# EasyEDA Pro project Flex-touch.eprj

# Schematic FlexTouch
Board Name: Board1; Create Date: 2025-05-13; Page Name: P1; Project Name: Flex-touch; Schematic Name: FlexTouch; Update Date: 2025-05-24; Company: EasyEDA.com; Page Size: A4; Version: V1.0
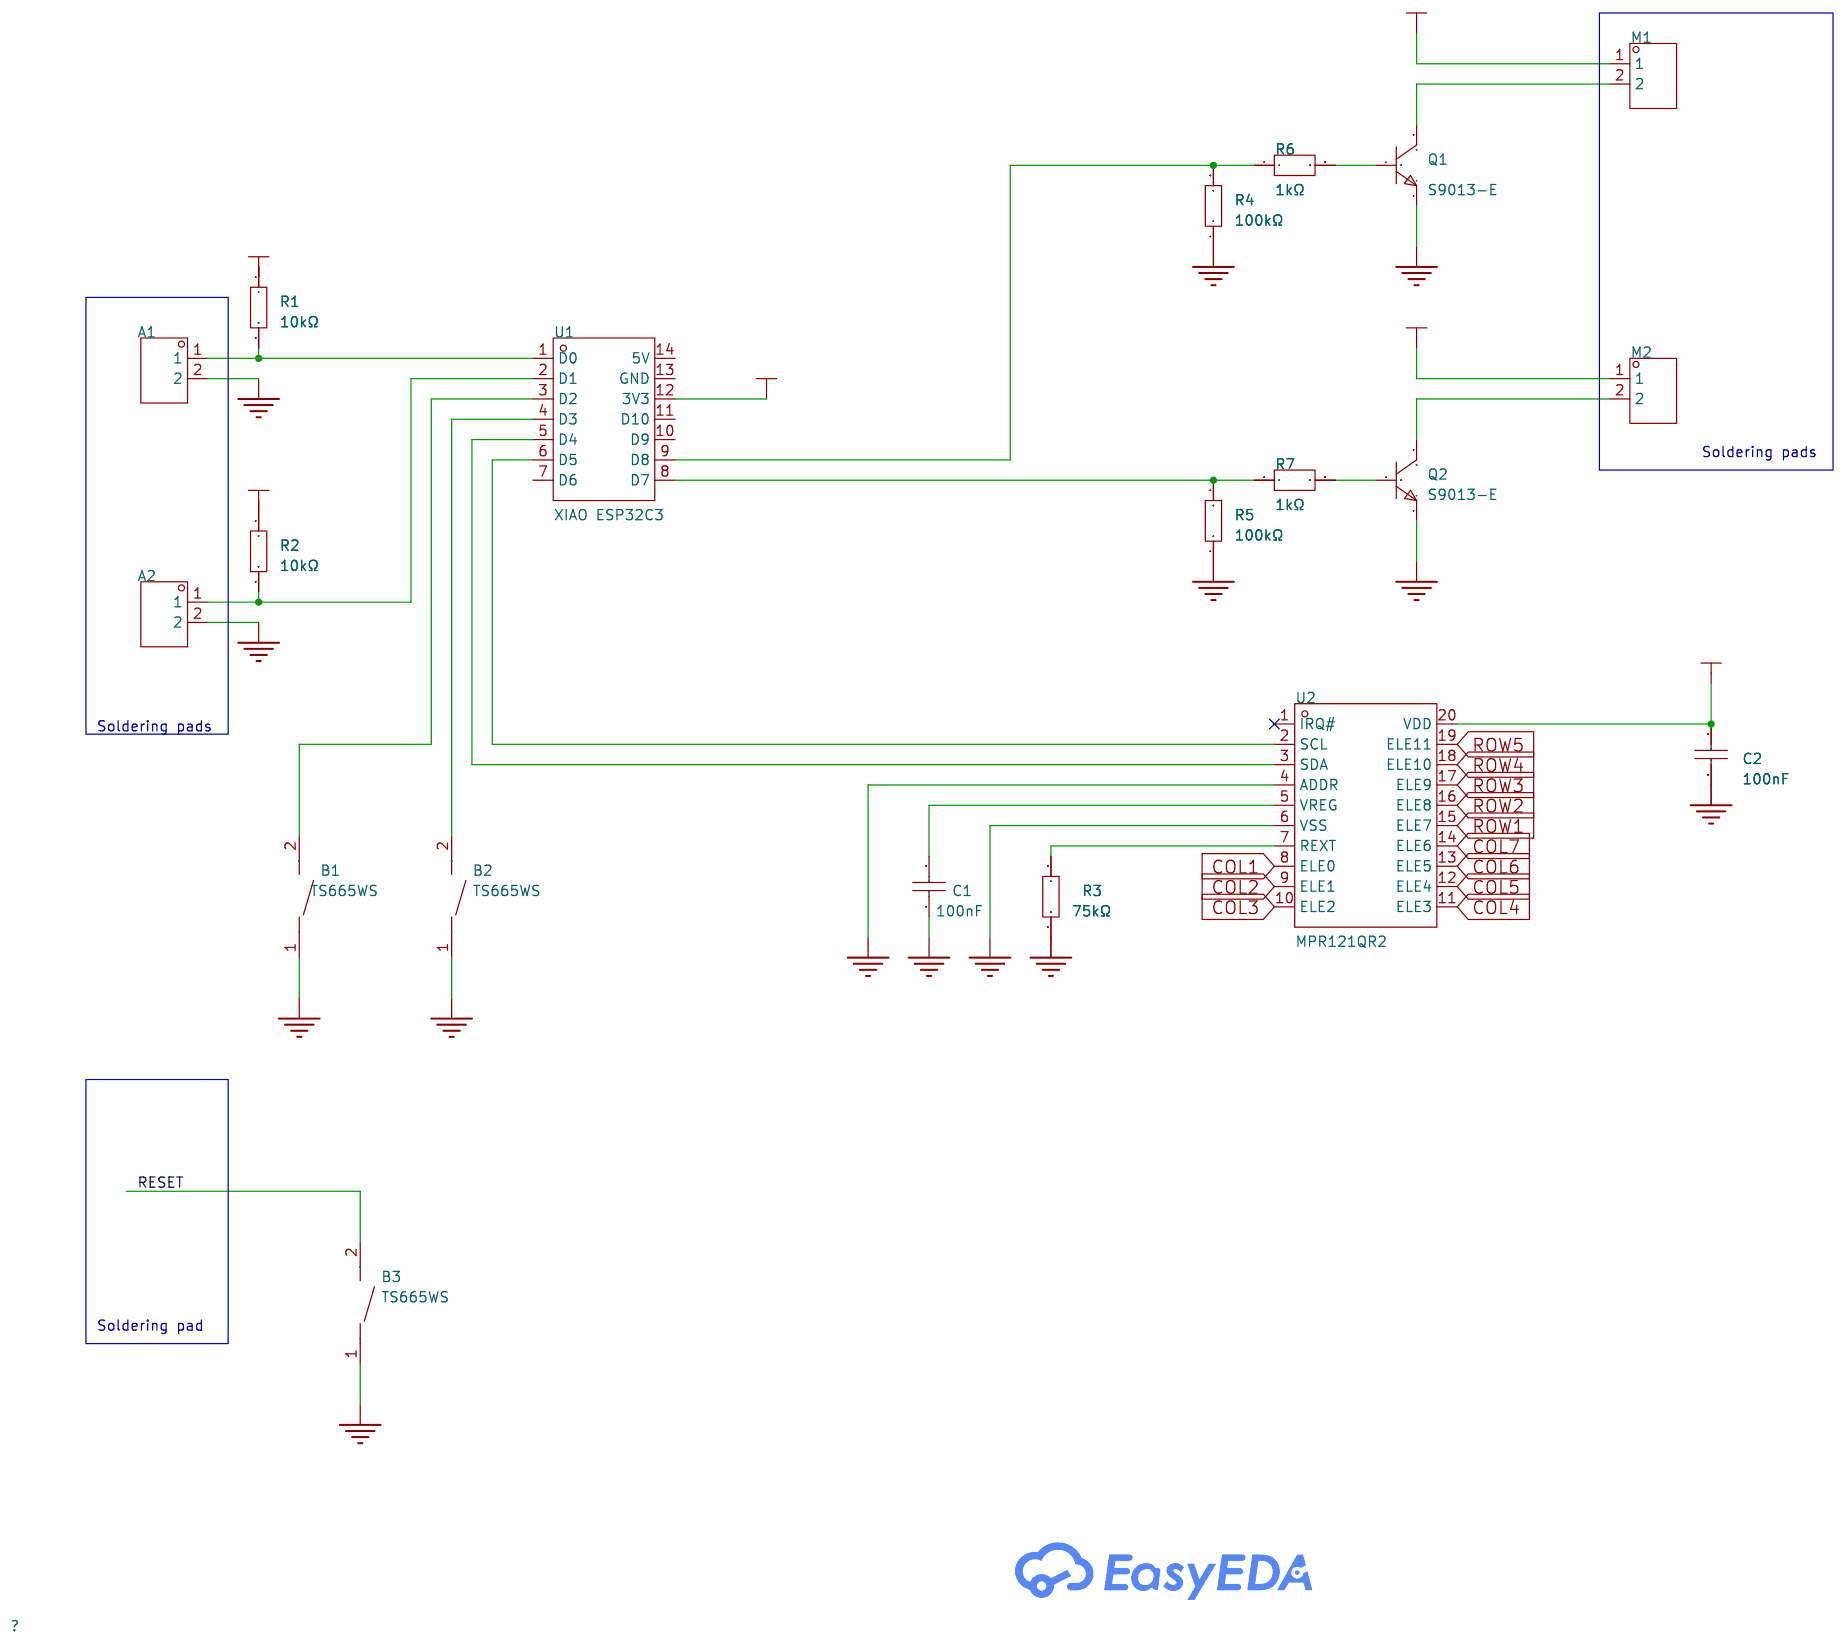
[diagram p0: schematic sheet]

## Parts
A1  B-2200S02P-A120  [HDR-TH_2P-P2.54-V-F]
A2  B-2200S02P-A120  [HDR-TH_2P-P2.54-V-F]
B1  TS665WS  [SW-SMD_L6.0-W6.0-LS6.6]
B2  TS665WS  [SW-SMD_L6.0-W6.0-LS6.6]
B3  TS665WS  [SW-SMD_L6.0-W6.0-LS6.6]
C1  100nF  [C0603]
C2  100nF  [C0603]
M1  B-2200S02P-A120  [HDR-TH_2P-P2.54-V-F]
M2  B-2200S02P-A120  [HDR-TH_2P-P2.54-V-F]
Q1  S9013-E  [SOT-23-3_L2.9-W1.3-P1.90-LS2.4-BR]
Q2  S9013-E  [SOT-23-3_L2.9-W1.3-P1.90-LS2.4-BR]
R1  10kΩ  [R0603]
R2  10kΩ  [R0603]
R3  75kΩ  [R0603]
R4  100kΩ  [R0603]
R5  100kΩ  [R0603]
R6  1kΩ  [R0603]
R7  1kΩ  [R0603]
U1  XIAO ESP32C3  [COMM-SMD_KQ-2801_V106]
U2  MPR121QR2  [QFN-20_L3.0-W3.0-P0.40-BL]

## Library data of the parts
A1 A2 M1 M2 = B-2200S02P-A120: 插孔结构:1x2P;间距:2.54mm;行距:-;安装类型:直插;排数:单排;总孔位数:2P;塑高:-;触头材质:黄铜;触头镀层:-;; LCSC Part Name: 间距:2.54mm 1x2P 直插; Supplier Part: C124411; Manufacturer: Ckmtw(灿科盟); Supplier Footprint: 插件,P=2.54mm; JLCPCB Part Class: Extended Part; Datasheet: https://atta.szlcsc.com/upload/public/pdf/source/20170821/C124418_1503303326113901572.pdf; Supplier: LCSC; Holes Structure: 1x2P; Pitch: 2.54mm; Mounting Type: 直插; Number of Rows: 单排; Number of Holes: 2P; Contact Material: 黄铜
B1-B3 = TS665WS_C398058: LCSC Part Name: 6*6*5mm 立贴 轻触开关; Supplier Part: C398058; Manufacturer: SHOU HAN(首韩); Supplier Footprint: SMD; JLCPCB Part Class: Extended Part; Datasheet: https://atta.szlcsc.com/upload/public/pdf/source/20190620/C398058_75EC11C2CCBC6DD113AE79D58CB25A40.pdf; Supplier: LCSC; Circuit: SPST; Actuator Style: Round Button; Operating Force: 200gf; Mounting Style: Brick nogging; Switch Length: 6mm; Switch Width: 6mm; Switch Height: 5mm; Contact Current: 50mA; Voltage Rating (DC): 12V
C1 C2 = 0603B104K500NT_C30926: LCSC Part Name: 100nF ±10% 50V; Supplier Part: C30926; Manufacturer: FH(风华); Manufacturer Part: 0603B104K500NT; Supplier Footprint: 0603; JLCPCB Part Class: Extended Part; Datasheet: https://atta.szlcsc.com/upload/public/pdf/source/20200305/C486355_26A10D38EF8C2A5C37091D0039909270.pdf; Supplier: LCSC; Tolerance: ±10%; Voltage Rating: 50V; Temperature Coefficient: X7R
Q1 Q2 = S9013-E: 晶体管类型:NPN;集电极电流(Ic):500mA;集射极击穿电压(Vceo):25V;耗散功率(Pd):300mW;直流电流增益(hFE):120@50mA,1V;; Supplier Part: C41371419; Manufacturer: MDD(辰达半导体); Supplier Footprint: SOT-23; JLCPCB Part Class: Extended Part; Datasheet: https://atta.szlcsc.com/upload/public/pdf/source/20241113/4DDBD2B8A7B6A974495B9B970C95E559.pdf; Supplier: LCSC; type: NPN; Current - Collector(Ic): 500mA; Collector - Emitter Voltage VCEO: 25V; Pd - Power Dissipation: 300mW; DC Current Gain: 120@50mA,1V; Transition frequency(fT): 150MHz; Current - Collector Cutoff: 100nA; Vce Saturation(VCE(sat)): 600mV; Operating Temperature: -55℃~+150℃
R1 R2 = RC0603FR-0710KL: LCSC Part Name: 厚膜电阻 10kΩ ±1% 100mW; Supplier Part: C98220; Manufacturer: YAGEO(国巨); Supplier Footprint: 0603; JLCPCB Part Class: Extended Part; Datasheet: https://atta.szlcsc.com/upload/public/pdf/source/20180927/C295883_E8D83085EA81BD7DE0B2B681138C15EE.pdf; Supplier: LCSC; Type: Thick Film Resistors; Tolerance: ±1%; Temperature Coefficient: ±100ppm/℃; Operating Temperature Range: -55℃~+155℃
R3 = RTT03753JTP: LCSC Part Name: 厚膜电阻 75kΩ ±5% 100mW; Supplier Part: C103814; Manufacturer: RALEC(旺诠); Supplier Footprint: 0603; JLCPCB Part Class: Extended Part; Datasheet: https://atta.szlcsc.com/upload/public/pdf/source/20191219/C158410_884373A5B7E1BC76BF57BC45A946C093.pdf; Supplier: LCSC; Type: Thick Film Resistors; Tolerance: ±5%; Temperature Coefficient: ±100ppm/℃; Operating Temperature Range: -55℃~+155℃
R4 R5 = 0603WAF1003T5E: 电阻类型:厚膜电阻;阻值:100kΩ;精度:±1%;功率:100mW;最大工作电压:75V;温度系数:±100ppm/℃;; LCSC Part Name: 100kΩ ±1% 100mW 厚膜电阻; Supplier Part: C25803; Manufacturer: UNI-ROYAL(厚声); Supplier Footprint: 0603; JLCPCB Part Class: Basic Part; Datasheet: https://atta.szlcsc.com/upload/public/pdf/source/20200306/C422600_1E6D84923E4A46A82E41ADD87F860B5C.pdf; Supplier: LCSC; Type: 厚膜电阻; Tolerance: ±1%; Power(Watts): 100mW; Overload Voltage (Max): 75V; Temperature Coefficient: ±100ppm/℃; Operating Temperature Range: -55℃~+155℃
R6 R7 = SCR0603J1K: 电阻类型:厚膜电阻;阻值:1kΩ;精度:±5%;功率:100mW;最大工作电压:75V;; LCSC Part Name: 厚膜电阻 1kΩ ±5% 100mW; Supplier Part: C3017736; Manufacturer: VO(翔胜); Supplier Footprint: 0603; JLCPCB Part Class: Extended Part; Datasheet: https://atta.szlcsc.com/upload/public/pdf/source/20220513/247AF9639BA21CF93567DC289CCC6A22.pdf; Supplier: LCSC; Type: 厚膜电阻; Tolerance: ±5%; Power(Watts): 100mW; Overload Voltage (Max): 75V; Operating Temperature Range: -55℃~+155℃
U1 = XIAO ESP32C3: Supplier Part: C19189385; Supplier Footprint: QFN-32_5X5_EP3.7; JLCPCB Part Class: Extended Part; Supplier: LCSC
U2 = MPR121QR2: Supplier Part: C91322; Manufacturer: NXP(恩智浦); Supplier Footprint: QFN-20(3x3); JLCPCB Part Class: Extended Part; Datasheet: https://atta.szlcsc.com/upload/public/pdf/source/20240710/4D4C0BE290CAA2FB24355067A81EC58A.pdf; Supplier: LCSC

## Nets
3V3: C2.2 M1.1 M2.1 R1.1 R2.1 U1.12(3V3) U2.20(VDD)
GND: A1.2 A2.2 B1.1(A) B2.1(A) B3.1(A) C1.1 C2.1 Q1.2(E) Q2.2(E) R3.1 R4.1 R5.1 U2.4(ADDR) U2.6(VSS)
COL1: U2.8(ELE0)
COL2: U2.9(ELE1)
COL3: U2.10(ELE2)
COL4: U2.11(ELE3)
COL5: U2.12(ELE4)
COL6: U2.13(ELE5)
COL7: U2.14(ELE6)
RESET: B3.2(B)
ROW1: U2.15(ELE7)
ROW2: U2.16(ELE8)
ROW3: U2.17(ELE9)
ROW4: U2.18(ELE10)
ROW5: U2.19(ELE11)
$1N1686: M1.2 Q1.3(C)
$1N1688: R4.2 R6.1 U1.9(D8)
$1N1689: Q1.1(B) R6.2
$1N2010: R5.2 R7.1 U1.8(D7)
$1N2011: M2.2 Q2.3(C)
$1N2012: Q2.1(B) R7.2
$1N2784: C1.2 U2.5(VREG)
$1N2840: R3.2 U2.7(REXT)
$1N2947: U1.5(D4) U2.3(SDA)
$1N2951: U1.6(D5) U2.2(SCL)
$1N3138: A1.1 R1.2 U1.1(D0)
$1N3210: A2.1 R2.2 U1.2(D1)
$1N3281: B1.2(B) U1.3(D2)
$1N3291: B2.2(B) U1.4(D3)

Not connected (* = marked no-connect by the designer): U1 7(D6) 10(D9) 11(D10) 13(GND) 14(5V); U2 1(IRQ#)*

## Notes on the sheet
- Soldering pads
- Soldering pads
- Soldering pad

# Board PCB1
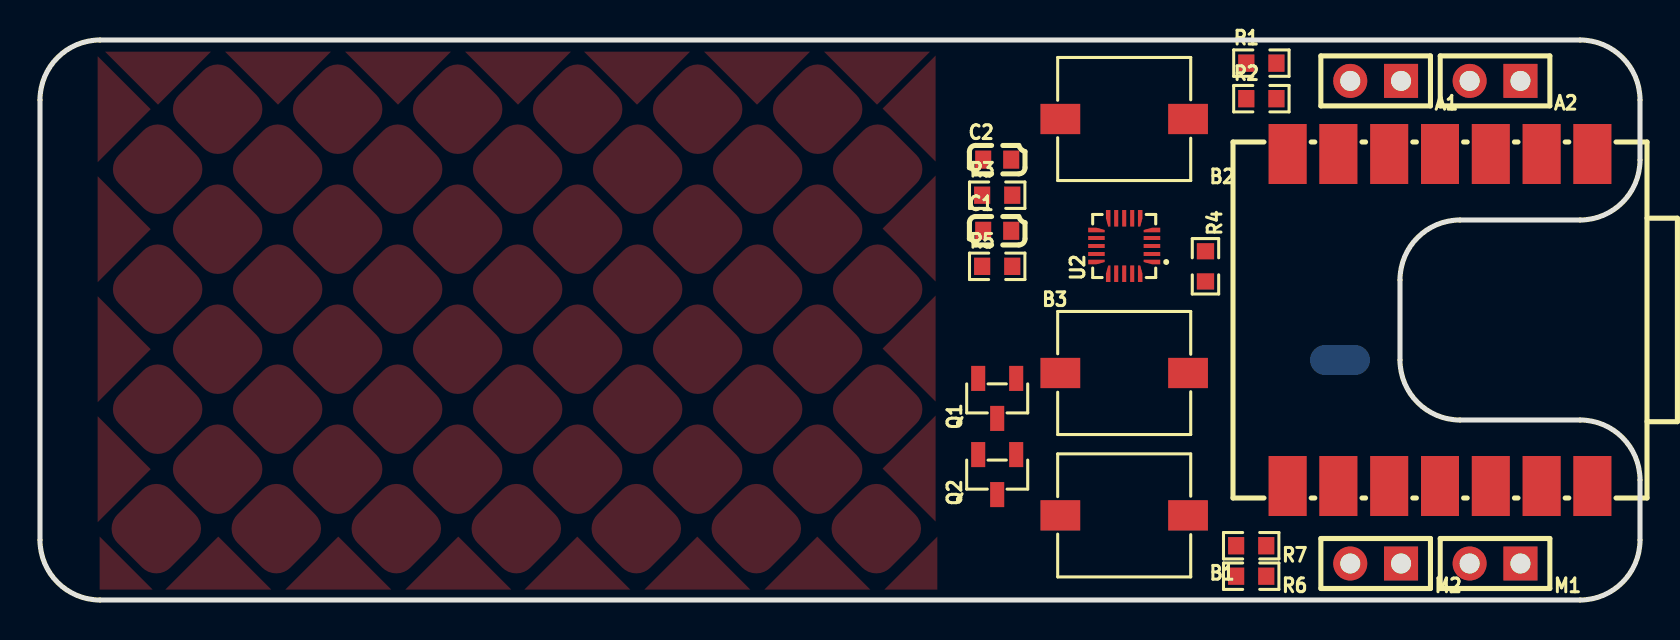
[diagram p1: board, top side]
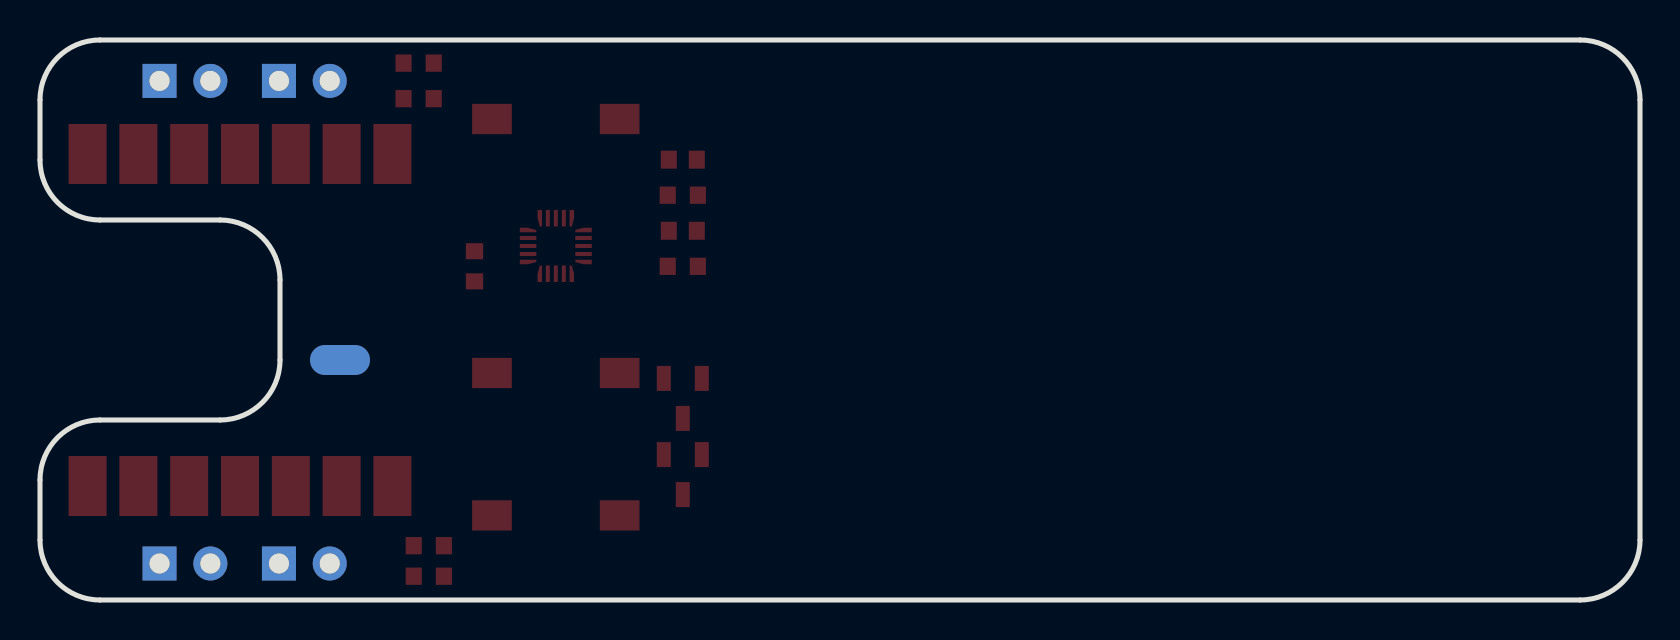
[diagram p2: board, bottom side, seen from below]

Outline 80 x 28 mm; copper layers: Top Layer, Bottom Layer. Coordinates in mm from the lower left corner of the outline.
Outline path: 0,25 arc(0.88,27.12) 3,28 77,28 arc(79.12,27.12) 80,25 80,22 arc(79.12,19.88) 77,19 71,19 arc(68.88,18.12) 68,16 68,12 arc(68.88,9.88) 71,9 77,9 arc(79.12,8.12) 80,6 80,3 arc(79.12,0.88) 77,0 3,0 arc(0.88,0.88) 0,3 0,25
Stack: Top Layer 0.035mm / Dielectric1 1.51mm FR4 er 4.5 / Bottom Layer 0.035mm

## Design rules (mm)
template: JLCPCB Capability(Two Layers Board)
spacing copperThickness1oz (default): track to track 0.102, other pairs 0.152 to 0.3
spacing copperThickness2oz: track to track 0.203, other pairs 0.152 to 0.3
track width copperThickness1oz (default): min 0.127, default 0.254, max 2.54
track width copperThickness2oz: min 0.203, default 0.254, max 2.54
differential pair differentialPair (default): width min 0.127, default 0.254, max 2.54; gap min 0.152, default 0.152
via viaSize (default): diameter min 0.5, default 0.61, max 10; hole min 0.3, default 0.305, max 6.3

## Placement (name value [footprint] x y rotation side)
A1  B-2200S02P-A120  [HDR-TH_2P-P2.54-V-F]  66.78 25.95 180 top
A2  B-2200S02P-A120  [HDR-TH_2P-P2.54-V-F]  72.75 25.95 180 top
B1  TS665WS  [SW-SMD_L6.0-W6.0-LS6.6]  54.21 4.23 180 top
B2  TS665WS  [SW-SMD_L6.0-W6.0-LS6.6]  54.21 24.05 180 top
B3  TS665WS  [SW-SMD_L6.0-W6.0-LS6.6]  54.21 11.35 0 top
C1  100nF  [C0603]  47.86 18.46 0 top
C2  100nF  [C0603]  47.86 22.02 0 top
M1  B-2200S02P-A120  [HDR-TH_2P-P2.54-V-F]  72.75 1.83 180 top
M2  B-2200S02P-A120  [HDR-TH_2P-P2.54-V-F]  66.78 1.83 180 top
NOREF  -  [Pad_e112]  65 12 0 top
Q1  S9013-E  [SOT-23-3_L2.9-W1.3-P1.90-LS2.4-BR]  47.86 10.08 90 top
Q2  S9013-E  [SOT-23-3_L2.9-W1.3-P1.90-LS2.4-BR]  47.86 6.27 90 top
R1  10kΩ  [R0603]  61.07 26.84 0 top
R2  10kΩ  [R0603]  61.07 25.07 0 top
R3  75kΩ  [R0603]  47.86 20.24 0 top
R4  100kΩ  [R0603]  58.27 16.68 270 top
R5  100kΩ  [R0603]  47.86 16.68 0 top
R6  1kΩ  [R0603]  60.56 1.19 180 top
R7  1kΩ  [R0603]  60.56 2.71 180 top
U1  XIAO ESP32C3  [COMM-SMD_KQ-2801_V106]  70 14 180 top
U2  MPR121QR2  [QFN-20_L3.0-W3.0-P0.40-BL]  54.21 17.7 90 top

## Footprints (pads in the part's own frame, mm; a bottom-side part is the same pattern mirrored in y, then rotated)
C0603
  rect 0.8x0.9 smd: 1(-0.7,0) 2(0.7,0)
COMM-SMD_KQ-2801_V106
  rect 1.9x3 smd: 1(-7.62,-8.3) 2(-5.08,-8.3) 3(-2.54,-8.3) 4(0,-8.3) 5(2.54,-8.3) 6(5.08,-8.3) 7(7.62,-8.3) 8(7.62,8.3) 9(5.08,8.3) 10(2.54,8.3) 11(0,8.3) 12(-2.54,8.3) 13(-5.08,8.3) 14(-7.62,8.3)
HDR-TH_2P-P2.54-V-F
  rect 1.7x1.7 hole 1: 1(-1.27,0)
  round 1.7 hole 1: 2(1.27,0)
Pad_e112
  oval 3x1.5 smd far side: 1(0,0)
QFN-20_L3.0-W3.0-P0.40-BL
  custom 0.224x0.825 smd: 1(-0.8,-1.387) 5(0.8,-1.387) 11(0.8,1.387) 15(-0.8,1.387)
  rect 0.2x0.825 smd: 2(-0.4,-1.387) 3(0,-1.387) 4(0.4,-1.387) 12(0.4,1.387) 13(0,1.387) 14(-0.4,1.387)
  custom 0.825x0.224 smd: 6(1.387,-0.8) 10(1.387,0.8) 16(-1.387,0.8) 20(-1.387,-0.8)
  rect 0.825x0.2 smd: 7(1.387,-0.4) 8(1.387,0) 9(1.387,0.4) 17(-1.387,0.4) 18(-1.387,0) 19(-1.387,-0.4)
R0603
  rect 0.806x0.864 smd: 1(-0.753,0) 2(0.753,0)
SOT-23-3_L2.9-W1.3-P1.90-LS2.4-BR
  rect 1.25x0.7 smd: 1(1,-0.95) 2(1,0.95) 3(-1,0)
SW-SMD_L6.0-W6.0-LS6.6
  rect 1.985x1.512 smd: 1(-3.192,0) 2(3.192,0)

## Nets
As in the schematic, except:
RESET: B3.2 NOREF.1

Pads without a net: U1 7 10 11 13 14; U2 1

## Copper pours and planes (outline as drawn; the poured copper is in the pictures)
COL1 on Top Layer: 3.65,11.78 8.12,11.78 8.12,7.3 3.65,7.3
COL1 on Top Layer: 3.65,17.78 8.12,17.78 8.12,13.3 3.65,13.3
COL1 on Top Layer: 3.25,27.42 8.55,27.42 8.55,24.77 3.25,24.77
COL1 on Top Layer: 3.65,23.78 8.12,23.78 8.12,19.3 3.65,19.3
COL1 on Top Layer: 3.58,5.81 8.05,5.81 8.05,1.33 3.58,1.33
COL2 on Top Layer: 9.65,23.78 14.12,23.78 14.12,19.3 9.65,19.3
COL2 on Top Layer: 9.25,27.42 14.55,27.42 14.55,24.77 9.25,24.77
COL2 on Top Layer: 9.65,17.78 14.12,17.78 14.12,13.3 9.65,13.3
COL2 on Top Layer: 9.65,11.78 14.12,11.78 14.12,7.3 9.65,7.3
COL2 on Top Layer: 9.58,5.81 14.05,5.81 14.05,1.33 9.58,1.33
COL4 on Top Layer: 15.65,11.78 20.12,11.78 20.12,7.3 15.65,7.3
COL4 on Top Layer: 21.65,17.78 26.12,17.78 26.12,13.3 21.65,13.3
COL4 on Top Layer: 21.65,23.78 26.12,23.78 26.12,19.3 21.65,19.3
COL4 on Top Layer: 15.25,27.42 20.55,27.42 20.55,24.77 15.25,24.77
COL4 on Top Layer: 15.65,23.78 20.12,23.78 20.12,19.3 15.65,19.3
COL4 on Top Layer: 21.65,11.78 26.12,11.78 26.12,7.3 21.65,7.3
COL4 on Top Layer: 21.25,27.42 26.55,27.42 26.55,24.77 21.25,24.77
COL4 on Top Layer: 21.58,5.81 26.05,5.81 26.05,1.33 21.58,1.33
COL4 on Top Layer: 15.65,17.78 20.12,17.78 20.12,13.3 15.65,13.3
COL4 on Top Layer: 15.58,5.81 20.05,5.81 20.05,1.33 15.58,1.33
COL5 on Top Layer: 27.2,27.42 32.5,27.42 32.5,24.77 27.2,24.77
COL5 on Top Layer: 27.58,5.81 32.05,5.81 32.05,1.33 27.58,1.33
COL5 on Top Layer: 27.65,23.78 32.12,23.78 32.12,19.3 27.65,19.3
COL5 on Top Layer: 27.65,17.78 32.12,17.78 32.12,13.3 27.65,13.3
COL5 on Top Layer: 27.65,11.78 32.12,11.78 32.12,7.3 27.65,7.3
COL6 on Top Layer: 33.65,11.78 38.12,11.78 38.12,7.3 33.65,7.3
COL6 on Top Layer: 33.65,23.78 38.12,23.78 38.12,19.3 33.65,19.3
COL6 on Top Layer: 33.58,5.81 38.05,5.81 38.05,1.33 33.58,1.33
COL6 on Top Layer: 33.2,27.42 38.5,27.42 38.5,24.77 33.2,24.77
COL6 on Top Layer: 33.65,17.78 38.12,17.78 38.12,13.3 33.65,13.3
COL7 on Top Layer: 39.65,11.78 44.12,11.78 44.12,7.3 39.65,7.3
COL7 on Top Layer: 39.58,5.81 44.05,5.81 44.05,1.33 39.58,1.33
COL7 on Top Layer: 39.2,27.42 44.5,27.42 44.5,24.77 39.2,24.77
COL7 on Top Layer: 39.65,23.78 44.12,23.78 44.12,19.3 39.65,19.3
COL7 on Top Layer: 39.65,17.78 44.12,17.78 44.12,13.3 39.65,13.3
ROW1 on Top Layer: 42.13,27.22 44.78,27.22 44.78,21.92 42.13,21.92
ROW1 on Top Layer: 30.65,26.78 35.12,26.78 35.12,22.3 30.65,22.3
ROW1 on Top Layer: 24.65,26.78 29.12,26.78 29.12,22.3 24.65,22.3
ROW1 on Top Layer: 2.88,27.19 5.53,27.19 5.53,21.89 2.88,21.89
ROW1 on Top Layer: 12.65,26.78 17.12,26.78 17.12,22.3 12.65,22.3
ROW1 on Top Layer: 36.65,26.78 41.12,26.78 41.12,22.3 36.65,22.3
ROW1 on Top Layer: 6.65,26.78 11.12,26.78 11.12,22.3 6.65,22.3
ROW1 on Top Layer: 18.65,26.78 23.12,26.78 23.12,22.3 18.65,22.3
ROW2 on Top Layer: 2.88,21.19 5.53,21.19 5.53,15.89 2.88,15.89
ROW2 on Top Layer: 42.13,21.22 44.78,21.22 44.78,15.92 42.13,15.92
ROW2 on Top Layer: 30.65,20.78 35.12,20.78 35.12,16.3 30.65,16.3
ROW2 on Top Layer: 18.65,20.78 23.12,20.78 23.12,16.3 18.65,16.3
ROW2 on Top Layer: 36.65,20.78 41.12,20.78 41.12,16.3 36.65,16.3
ROW2 on Top Layer: 6.65,20.78 11.12,20.78 11.12,16.3 6.65,16.3
ROW2 on Top Layer: 24.65,20.78 29.12,20.78 29.12,16.3 24.65,16.3
ROW2 on Top Layer: 12.65,20.78 17.12,20.78 17.12,16.3 12.65,16.3
ROW3 on Top Layer: 12.65,14.78 17.12,14.78 17.12,10.3 12.65,10.3
ROW3 on Top Layer: 24.65,14.78 29.12,14.78 29.12,10.3 24.65,10.3
ROW3 on Top Layer: 42.13,15.22 44.78,15.22 44.78,9.92 42.13,9.92
ROW3 on Top Layer: 30.65,14.78 35.12,14.78 35.12,10.3 30.65,10.3
ROW3 on Top Layer: 6.65,14.78 11.12,14.78 11.12,10.3 6.65,10.3
ROW3 on Top Layer: 18.65,14.78 23.12,14.78 23.12,10.3 18.65,10.3
ROW3 on Top Layer: 2.88,15.19 5.53,15.19 5.53,9.89 2.88,9.89
ROW3 on Top Layer: 36.65,14.78 41.12,14.78 41.12,10.3 36.65,10.3
ROW4 on Top Layer: 30.65,8.78 35.12,8.78 35.12,4.3 30.65,4.3
ROW4 on Top Layer: 18.65,8.78 23.12,8.78 23.12,4.3 18.65,4.3
ROW4 on Top Layer: 42.13,9.22 44.78,9.22 44.78,3.92 42.13,3.92
ROW4 on Top Layer: 6.65,8.78 11.12,8.78 11.12,4.3 6.65,4.3
ROW4 on Top Layer: 36.65,8.78 41.12,8.78 41.12,4.3 36.65,4.3
ROW4 on Top Layer: 2.88,9.19 5.53,9.19 5.53,3.89 2.88,3.89
ROW4 on Top Layer: 24.65,8.78 29.12,8.78 29.12,4.3 24.65,4.3
ROW4 on Top Layer: 12.65,8.78 17.12,8.78 17.12,4.3 12.65,4.3
ROW5 on Top Layer: 24.21,3.17 29.52,3.17 29.52,0.52 24.21,0.52
ROW5 on Top Layer: 42.21,3.17 44.87,3.17 44.87,0.52 42.21,0.52
ROW5 on Top Layer: 12.26,3.17 17.57,3.17 17.57,0.52 12.26,0.52
ROW5 on Top Layer: 30.21,3.17 35.52,3.17 35.52,0.52 30.21,0.52
ROW5 on Top Layer: 18.26,3.17 23.57,3.17 23.57,0.52 18.26,0.52
ROW5 on Top Layer: 36.21,3.17 41.52,3.17 41.52,0.52 36.21,0.52
ROW5 on Top Layer: 6.26,3.17 11.57,3.17 11.57,0.52 6.26,0.52
ROW5 on Top Layer: 2.98,3.17 5.63,3.17 5.63,0.52 2.98,0.52

## Text on the board
Document Layer: Apple Pencil D=8.9mm / Perimeter =~ 28mm
